# EAGLE design E_Key_BT (EAGLE 6.4)
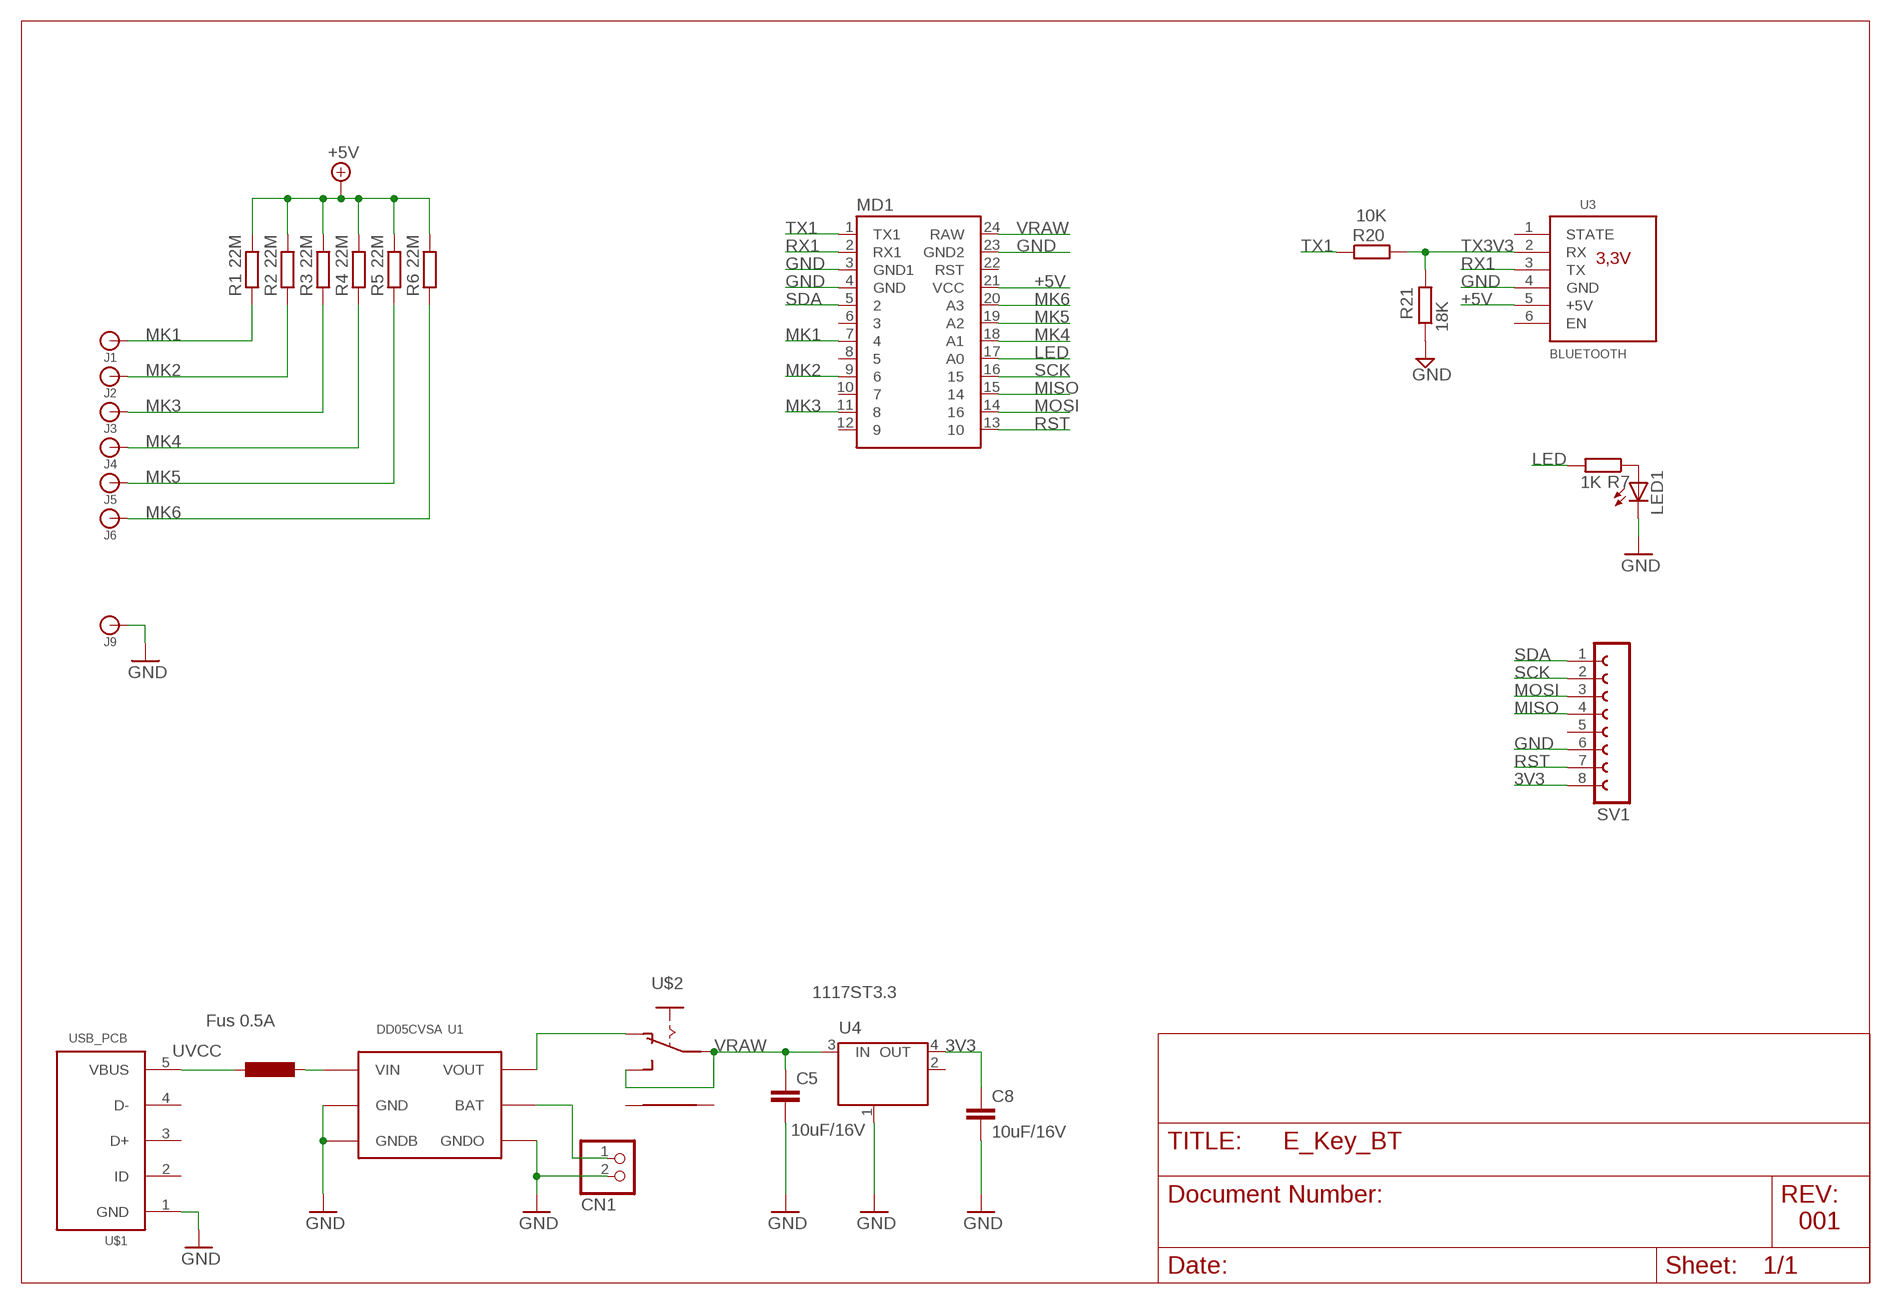
[diagram p0: schematic, sheet 1]

## Parts
C5  10uF/16V  C-EUC1206  [C1206]
C8  10uF/16V  C-EUC1206  [C1206]
CN1  JST_2PIN-THM-RA  [JST-PH-2-THM-RA]
F1  Fus 0.5A  L-EU  [R1206]
J1  Hole  BANANA_CONN  [BANANA_CONN]
J2  Hole  BANANA_CONN  [BANANA_CONN]
J3  Hole  BANANA_CONN  [BANANA_CONN]
J4  Hole  BANANA_CONN  [BANANA_CONN]
J5  Hole  BANANA_CONN  [BANANA_CONN]
J6  Hole  BANANA_CONN  [BANANA_CONN]
J9  Hole  BANANA_CONN  [BANANA_CONN]
LED1  LED3MM  [LED3MM]
MD1  PRO_MICRO  [PRO_MICRO]
R1  22M  R-EU_R0603  [R0603]
R2  22M  R-EU_R0603  [R0603]
R3  22M  R-EU_R0603  [R0603]
R4  22M  R-EU_R0603  [R0603]
R5  22M  R-EU_R0603  [R0603]
R6  22M  R-EU_R0603  [R0603]
R7  1K  R-EU_R0603  [R0603]
R20  10K  R-EU_R0603  [R0603]
R21  18K  R-EU_R0603  [R0603]
SV1  FE08-1  [FE08]
U1  DD05CVSA  [DD05CVSA]
U3  BLUETOOTH  BLUETOOTH_MODULE  [BLUETOOTH_MODULE]
U4  1117ST3.3  MC33269ST-3.3T3  [SOT223]
U$1  USB_PCB  [USB_PCB]
U$2  ESCORNA_SK12F14D  [ESCORNA_SK-12D07]

## Nets
3V3: C8.1 SV1.8 U4.4(OUT)
+5V: MD1.21(VCC) R1.2 R2.2 R3.2 R4.2 R5.2 R6.2 U3.5(+5V)
GND [power]: C5.2 C8.2 CN1.2 J9.P$1 LED1.K(C) MD1.3(GND1) MD1.4(GND) MD1.23(GND2) R21.1 SV1.6 U1.P$2(GND) U1.P$4(GNDB) U1.P$5(GNDO) U3.4(GND) U4.1(GND/ADJ) U$1.1(GND)
LED: MD1.17(A0) R7.2
MISO: MD1.15 SV1.4
MK1: J1.P$1 MD1.7 R1.1
MK2: J2.P$1 MD1.9 R2.1
MK3: J3.P$1 MD1.11 R3.1
MK4: J4.P$1 MD1.18(A1) R4.1
MK5: J5.P$1 MD1.19(A2) R5.1
MK6: J6.P$1 MD1.20(A3) R6.1
MOSI: MD1.14 SV1.3
N$1: U1.P$6(VOUT) U$2.P$2(O)
N$2: LED1.A R7.1
N$4: F1.1 U1.P$1(VIN)
N$6: CN1.1 U1.P$3(BAT)
RST: MD1.13 SV1.7
RX1: MD1.2(RX1) U3.3(TX)
SCK: MD1.16 SV1.2
SDA: MD1.5 SV1.1
TX1: MD1.1(TX1) R20.1
TX3V3: R20.2 R21.2 U3.2(RX)
UVCC: F1.2 U$1.5(VBUS)
VRAW: C5.1 MD1.24(RAW) U4.3(IN) U$2.P$1(P) U$2.P$3(S)
Unconnected: MD1.6 MD1.8 MD1.10 MD1.12 MD1.22(RST) SV1.5 U3.1(STATE) U3.6(EN) U4.2(OUT) U$1.2(ID) U$1.3(D+) U$1.4(D-) U$2.P$4 U$2.P$5

## Notes on the sheet
- 001

## Library data of the parts
C5 C8 = rcl:C-EU: CAPACITOR, European symbol
CN1 = adafruit:JST_2PIN: JST 2-Pin Connectors of various flavors SMT-RA (S2B-PH-SM4) 4UConnector #17311 SMT (B2B-PH-SM4) THM-RA (S2B-PH) THM (B2B-PH)
F1 = rcl:L-EU: INDUCTOR, European symbol
J1-J6 J9 = SparkFun-Connectors:BANANA_CONN: Through-hole banana jack
LED1 = led:LED: LED OSRAM: - CHIPLED LG R971, LG N971, LY N971, LG Q971, LY Q971, LO R971, LY R971 LH N974, LH R974 LS Q976, LO Q976, LY Q976 LO Q996 - Hyper CHIPLED LW Q18S LB Q993, LB Q99A, LB R99A - SideLED LS A670, LO A670, LY A670, LG A670, LP A670 LB A673, LV A673, LT A673, LW A673 LH A674 LY A675 LS A676, LA A676, LO A676, LY A676, LW A676 LS A679, LY A679, LG A679 - Hyper Micro SIDELED® LS Y876, LA Y876, LO Y876, LY Y876 LT Y87S - SmartLED LW L88C, LW L88S LB L89C, LB L89S, LG L890 LS L89K, LO L89K, LY L89K LS L896, LA L896, LO L896, LY L896 - TOPLED LS T670, LO T670, LY T670, LG T670, LP T670 LSG T670, LSP T670, LSY T670, LOP T670, LYG T670 LG T671, LOG T671, LSG T671 LB T673, LV T673, LT T673, LW T673 LH T674 LS T676, LA T676, LO T676, LY T676, LB T676, LH T676, LSB T676, LW T676 LB T67C, LV T67C, LT T67C, LS T67K, LO T67K, LY T67K, LW E67C LS E67B, LA E67B, LO E67B, LY E67B, LB E67C, LV E67C, LT E67C LW T67C LS T679, LY T679, LG T679 LS T770, LO T770, LY T770, LG T770, LP T770 LB T773, LV T773, LT T773, LW T773 LH T774 LS E675, LA E675, LY E675, LS T675 LS T776, LA T776, LO T776, LY T776, LB T776 LHGB T686 LT T68C, LB T68C - Hyper Mini TOPLED® LB M676 - Mini TOPLED Santana® LG M470 LS M47K, LO M47K, LY M47K Source: http://www.osram.convergy.de LUXEON: - LUMILED® LXK2-PW12-R00, LXK2-PW12-S00, LXK2-PW14-U00, LXK2-PW14-V00 LXK2-PM12-R00, LXK2-PM12-S00, LXK2-PM14-U00 LXK2-PE12-Q00, LXK2-PE12-R00, LXK2-PE12-S00, LXK2-PE14-T00, LXK2-PE14-U00 LXK2-PB12-K00, LXK2-PB12-L00, LXK2-PB12-M00, LXK2-PB14-N00, LXK2-PB14-P00, LXK2-PB14-Q00 LXK2-PR12-L00, LXK2-PR12-M00, LXK2-PR14-Q00, LXK2-PR14-R00 LXK2-PD12-Q00, LXK2-PD12-R00, LXK2-PD12-S00 LXK2-PH12-R00, LXK2-PH12-S00 LXK2-PL12-P00, LXK2-PL12-Q00, LXK2-PL12-R00 Source: www.luxeon.com KINGBRIGHT: KA-3528ASYC Source: www.kingbright.com
MD1 = Arduino_pro_micro:PRO_MICRO
R1-R7 R20 R21 = rcl:R-EU_: RESISTOR, European symbol
SV1 = con-lsta:FE08-1: FEMALE HEADER; OC_FARNELL: unknown; OC_NEWARK: unknown
U1 = escorna_LBREscorna_CPU_2_10:DD05CVSA
U3 = escorna_LBREscorna_CPU_2_10:BLUETOOTH_MODULE
U4 = linear:MC33269ST*: Adjustable Output Low Dropout Voltage Regulator 800 mA Source: http://www.onsemi.com/pub/Collateral/MC33269-D.PDF
U$1 = escorna_LBREscorna_CPU_2_10:USB_PCB
U$2 = escorna_ELIB:ESCORNA_SK12F14

## Net classes
0 default: width 0.254 mm, drill 0.61 mm, clearance 0.254 mm
1 power: width 0.254 mm, drill 0.61 mm, clearance 0.254 mm

## Board
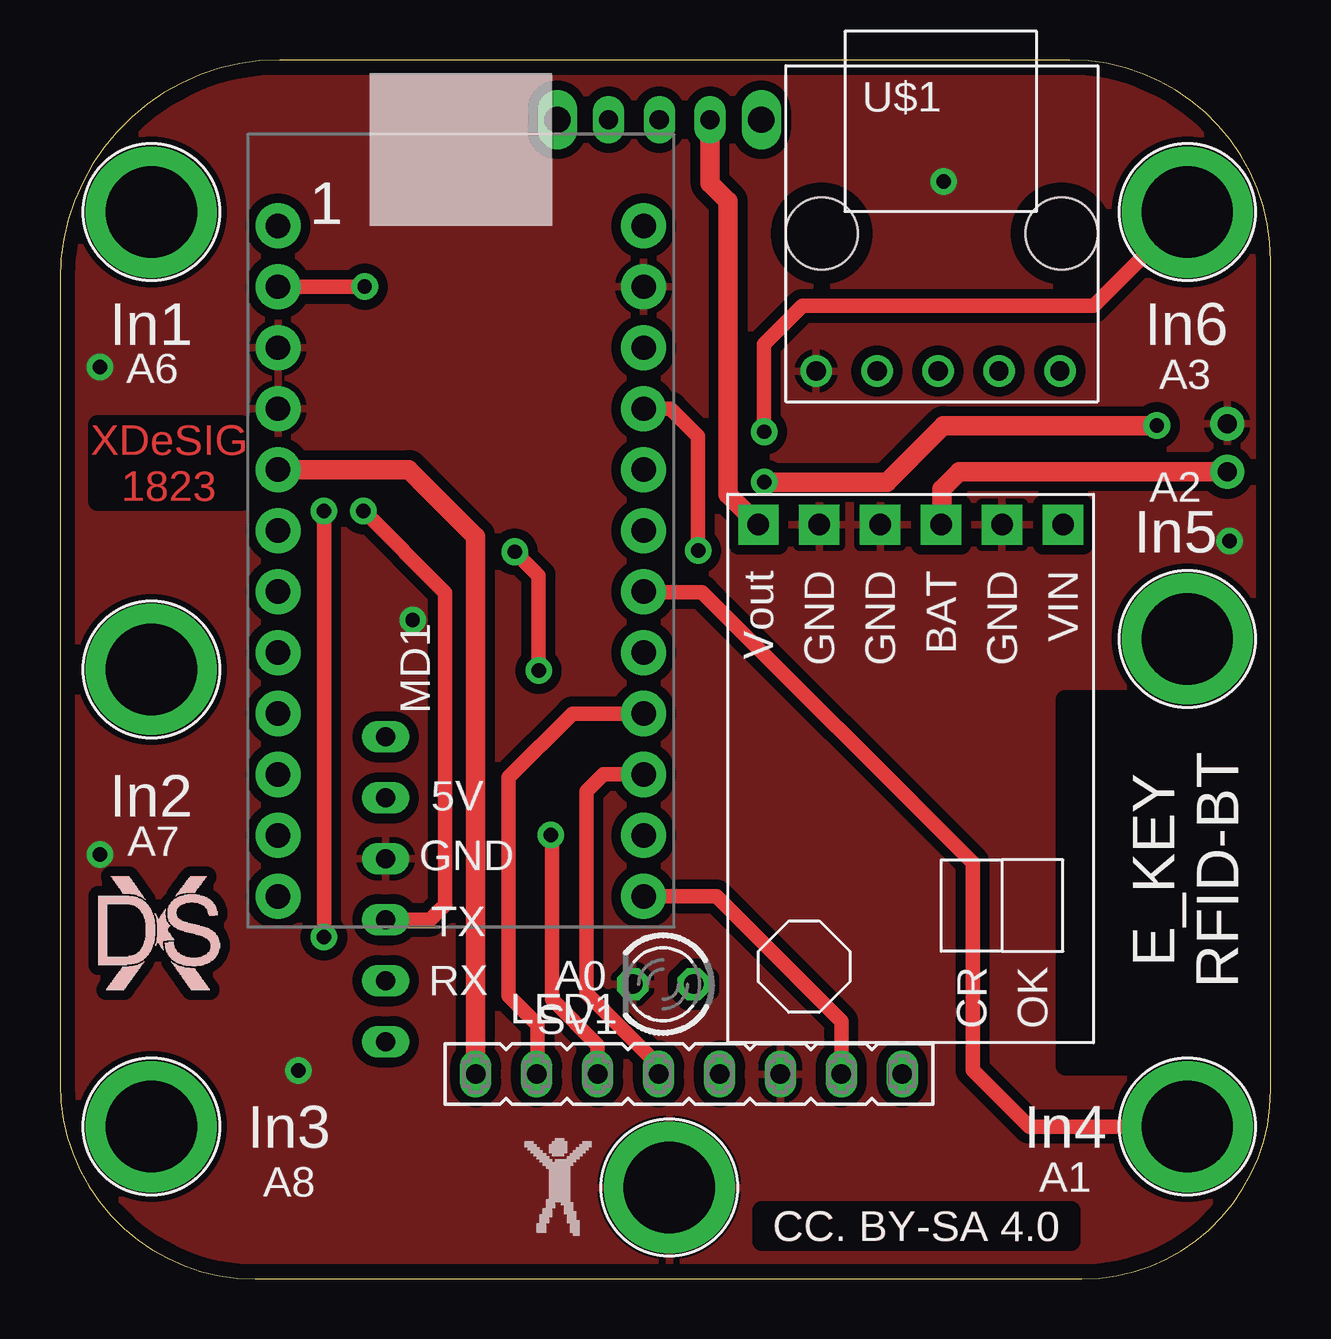
[diagram p1: board, top side]
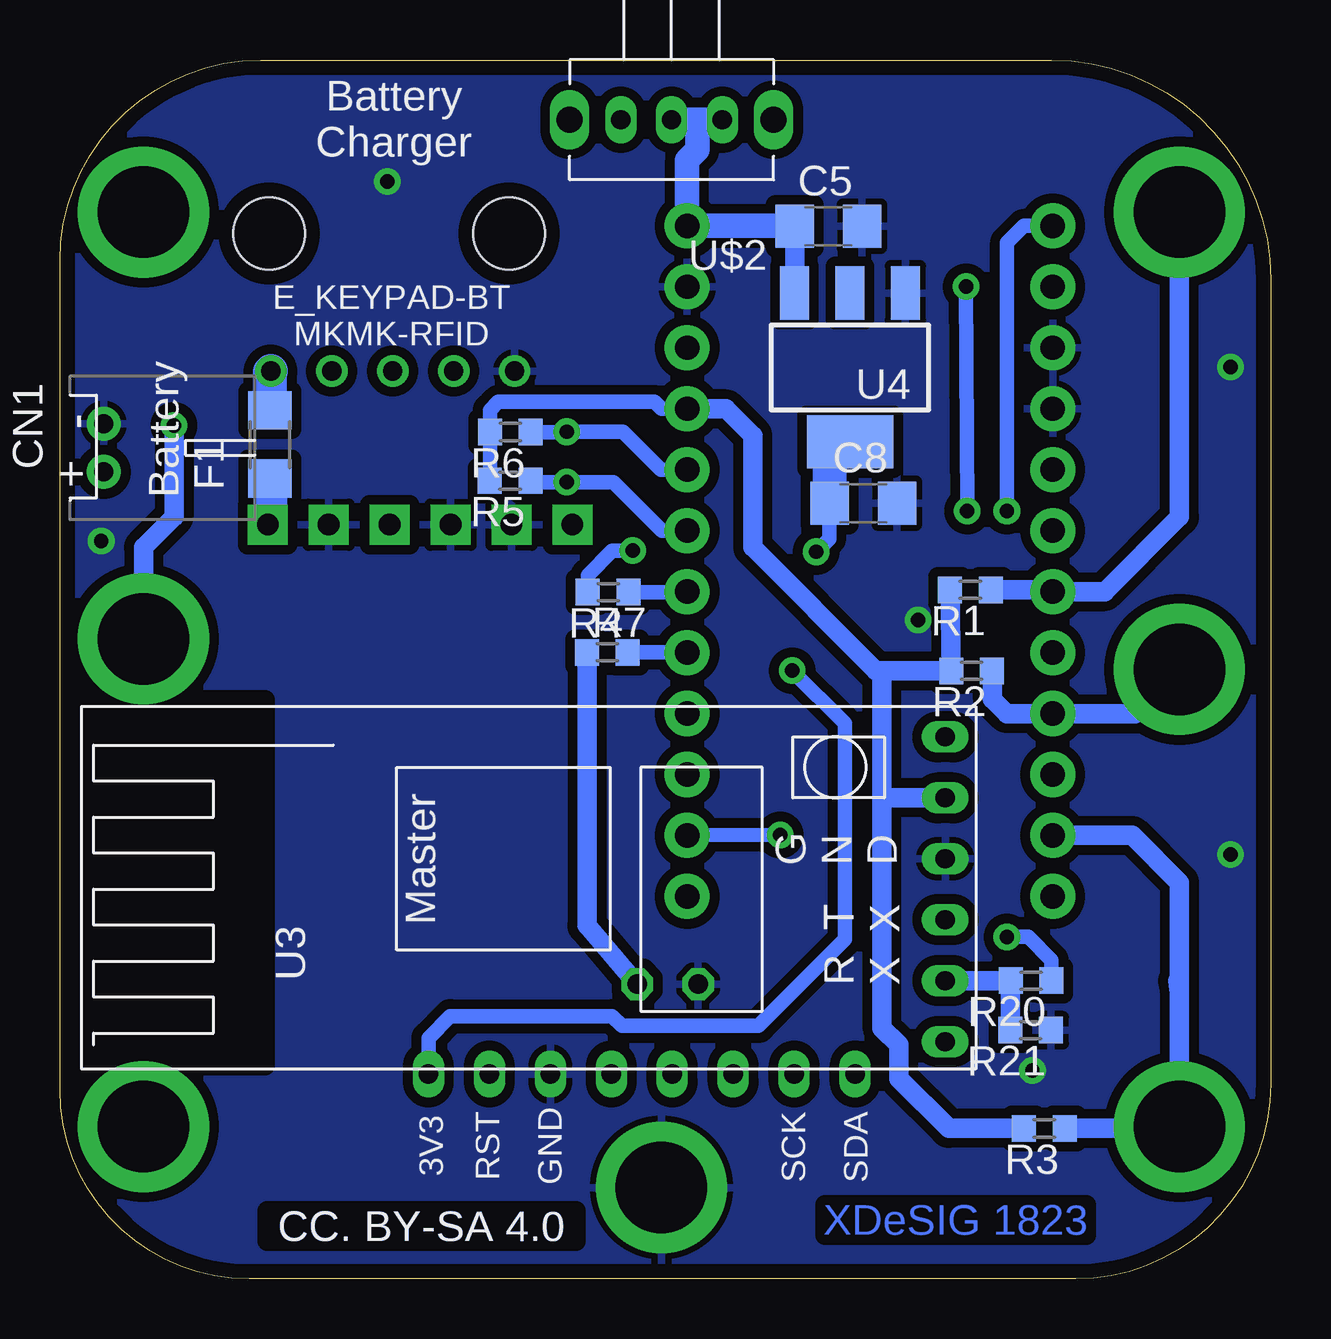
[diagram p2: board, bottom side, seen from below]

Size 50.47 x 50.79 mm. Coordinates in mm from the lower left corner, seen from the top.
Outline: 42.1,50.79 9.15,50.79 arc90 0,41.64 0,8.13 arc90 8.13,0 42.59,0 arc90 50.47,7.88 50.47,42.42 arc90 42.1,50.79
Copper layers (1*16): Top 0.035mm / dielectric 1.5mm / Bottom 0.035mm
Design rules "default": minimum track width 10mil, minimum drill 22mil, track to track 10mil, track to pad 10mil, pad to pad 8mil, via to via 12mil, smd to smd 8mil, copper to edge 24mil, drill to drill 12mil, minimum pad ring 10mil, minimum via ring 10mil, stop-mask expansion 2mil, vias tented up to drill 30mil, thermal gap 10mil
tRestrict: area 41.9,8.9 to 49.5,24.1
bRestrict: area 41.9,8.9 to 49.5,24.1

### Footprints (pad centres in the part's own frame; a part is rotated, then mirrored left to right if it is on the bottom)
C1206 = smd 1.6 x 1.8: 1 -1.4,0; 2 1.4,0
JST-PH-2-THM-RA = drill 0.8 pad 1.422: 1 1,0; 2 -1,0
R1206 = smd 1.6 x 1.803: 1 -1.422,0; 2 1.422,0
BANANA_CONN = drill 3.81 pad 5.461: P$1 0,0
LED3MM = drill 0.813 octagon: A -1.27,0; K 1.27,0
PRO_MICRO = drill 1.016 pad 1.88: 1 -7.62,11.43; 2 -7.62,8.89; 3 -7.62,6.35; 4 -7.62,3.81; 5 -7.62,1.27; 6 -7.62,-1.27; 7 -7.62,-3.81; 8 -7.62,-6.35; 9 -7.62,-8.89; 10 -7.62,-11.43; 11 -7.62,-13.97; 12 -7.62,-16.51; 13 7.62,-16.51; 14 7.62,-13.97; 15 7.62,-11.43; 16 7.62,-8.89; 17 7.62,-6.35; 18 7.62,-3.81; 19 7.62,-1.27; 20 7.62,1.27; 21 7.62,3.81; 22 7.62,6.35; 23 7.62,8.89; 24 7.62,11.43
R0603 = smd 1 x 1.1: 1 -0.85,0; 2 0.85,0
FE08 = drill 0.813 long: 1 -8.89,0; 2 -6.35,0; 3 -3.81,0; 4 -1.27,0; 5 1.27,0; 6 3.81,0; 7 6.35,0; 8 8.89,0
DD05CVSA = drill 0.9 pad 1.676 square: P$1 0,0; P$2 2.54,0; P$3 5.08,0; P$4 7.62,0; P$5 10.16,0; P$6 12.7,0
BLUETOOTH_MODULE = drill 0.8 long: 1 -6.35,-17.78; 2 -3.81,-17.78; 3 -1.27,-17.78; 4 1.27,-17.78; 5 3.81,-17.78; 6 6.35,-17.78
SOT223 = smd 1.219 x 2.235: 1 -2.311,-3.099; 2 0,-3.099; 3 2.311,-3.099 | smd 3.6 x 2.2: 4 0,3.099
USB_PCB = drill 0.8: 1 -5.08,-5.08; 2 -2.54,-5.08; 3 0,-5.08; 4 2.54,-5.08; 5 5.08,-5.08 | hole 3: -4.85,0.65; 5.15,0.65
ESCORNA_SK-12D07 = drill 0.8 long: P$1 0,0; P$2 2.115,0; P$3 -2.115,0 | drill 1.1 pad 1.27 long: P$4 -4.25,0; P$5 4.25,0

### Placement (x,y rotation side)
C5  18.44,43.86 0 bottom
C8  16.98,32.32 0 bottom
CN1  48.65,34.63 270 bottom
F1  41.72,34.77 90 bottom
J1  3.81,44.45 0 top
J2  3.81,25.4 0 top
J3  3.81,6.35 0 top
J4  46.99,6.35 0 top
J5  46.99,26.67 0 top
J6  46.99,44.45 0 top
J9  25.4,3.81 0 top
LED1  25.14,12.28 180 top
MD1  16.71,32.45 0 top
R1  12.52,28.71 180 bottom
R2  12.47,25.34 180 bottom
R3  9.44,6.27 180 bottom
R4  27.62,28.62 180 bottom
R5  31.71,33.26 180 bottom
R6  31.7,35.29 180 bottom
R7  27.66,26.11 0 bottom
R20  9.99,12.43 180 bottom
R21  10.01,10.37 180 bottom
SV1  26.22,8.54 0 top
U1  41.81,31.43 180 top
U3  31.35,16.24 90 bottom
U4  17.54,37.98 180 bottom
U$1  36.6,42.91 0 top
U$2  24.98,48.3 180 bottom
U$3  [XDESIG_CU]  1.6,12.05 0 top
U$4  [BODY]  18.79,1.87 0 top
U$5  [XDESIG]  1.6,12.05 0 top

### Tracks (layer width: path | path; a pad name or v marks a point on that pad's centre or on a via)
3V3  (via drill 0.6)
  Top 0.61: v19.95,25.35 19.95,29.3 v18.95,30.3
  Bottom 0.61: SV1.8 35.11,10.04 34.2,10.95 27.45,10.95 27.05,10.55 21.35,10.55 17.75,14.15 17.75,23.15 v19.95,25.35 20,25.3 | v18.95,30.3 18.4,30.85 18.4,32.3 C8.1
  Bottom 0.813: 17.94,34.48 U4.4
  Bottom 1.422: C8.1 18.38,34.04 17.94,34.48
+5V  (via drill 0.6)
  Top 0.61: MD1.21 25.45,36.26 26.6,35.11 v26.6,30.35
  Bottom 0.61: R6.2 32.6,35.5 | R6.2 32.55,36.2 32.2,36.55 25.69,36.55 25.4,36.26 MD1.21 | R6.2 R5.2 | R4.2 28.47,29.33 27.45,30.35 v26.6,30.35
  Bottom 0.813: R1.2 R2.2 16.2,25.34 | 16.2,20.32 16.2,25.34 | R3.2 13.42,6.27 15.5,8.35 15.5,9.75 16.2,10.45 16.2,20.32 | U3.5 15.93,20.05 16.2,20.32 | 16.2,25.34 16.45,25.34 21.59,30.48 21.59,35.14 22.7,36.25 MD1.21
GND  (via drill 0.6)
  other vias: 36.83,45.72 14.7,27.45 9.94,8.69 1.67,38 1.67,17.68 48.75,30.75
  pour Bottom (isolate 0.406): -1.27,52.07 52.07,52.07 52.07,-3.81 -1.27,-3.81
  pour Top (isolate 0.406): -1.27,52.07 52.07,52.07 52.07,-2.54 -1.27,-2.54
LED
  Bottom 0.61: R7.2 MD1.17
MISO
  Top 0.61: SV1.4 24.95,8.9 21.95,11.9 21.95,20.32 22.65,21.02 MD1.15
MK1
  Bottom 0.813: J1.P$1 3.81,31.75 6.92,28.64 MD1.7 9.16,28.71 R1.1
MK2
  Bottom 0.813: R2.1 11.6,25.32 11.6,24.15 11.01,23.56 MD1.9 5.65,23.56 J2.P$1
MK3
  Bottom 0.813: 3.81,11.95 3.81,16.51 5.78,18.48 MD1.11 | 3.81,11.95 J3.P$1 3.89,6.27 R3.1 | 3.88,12.42 3.81,11.95
MK4
  Top 0.61: J4.P$1 40.4,6.35 38.05,8.7 38.05,17.34 R4.1 24.35,28.62 MD1.18
  Bottom 0.61: R4.1 24.35,28.62 MD1.18
MK5  (via drill 0.6)
  Top 0.813: v29.35,33.2 34.47,33.2 36.83,35.56 v45.72,35.56
  Bottom 0.61: R5.1 30.8,33.2 v29.35,33.2 27.4,33.2 25.38,31.18 MD1.19
  Bottom 0.813: v45.72,35.56 45.72,31.75 46.99,30.48 J5.P$1
MK6  (via drill 0.6)
  Top 0.61: J6.P$1 43.09,40.55 30.95,40.55 29.35,38.95 v29.35,35.3
  Bottom 0.61: R6.1 29.61,35.29 v29.35,35.3 27,35.3 25.42,33.72 MD1.20
MOSI  (via drill 0.6)
  Top 0.61: SV1.3 22.41,9.74 20.5,11.65 20.5,18.45 v20.45,18.5
  Bottom 0.61: v20.45,18.5 v20.44,18.5 MD1.14
N$1
  Top 0.813: U$2.P$2 27.1,45.65 27.85,44.9 27.85,32.69 U1.P$6
N$2
  Bottom 0.813: R7.1 28.51,14.73 LED1.A
N$4
  Bottom 1.422: F1.1 41.72,31.52 U1.P$1
N$6
  Top 0.813: CN1.1 37.48,33.63 36.75,32.9 36.75,31.45 U1.P$3
RST
  Top 0.61: SV1.7 32.57,10.73 27.36,15.94 MD1.13
RX1  (via drill 0.6)
  Top 0.61: U3.3 15.42,14.97 16.05,15.6 16.05,28.6 v12.65,32 | MD1.2 v12.69,41.34 v12.7,41.35
  Bottom 0.61: v12.65,32 v12.7,41.35
SCK
  Top 0.61: SV1.2 19.9,8.57 19.9,10.6 18.7,11.8 18.7,20.9 21.36,23.56 MD1.16
SDA
  Top 0.813: SV1.1 17.33,30.93 14.54,33.72 MD1.5
TX1  (via drill 0.6)
  Top 0.61: v11,14.25 v11,32
  Bottom 0.61: R20.1 9.14,13.29 10.1,14.25 v11,14.25 | v11,32 11,43.18 10.3,43.88 MD1.1
TX3V3
  Bottom 0.813: R21.2 10.86,12.11 R20.2 U3.2
UVCC
  Bottom 1.422: F1.2 41.72,37.79 U$1.5
VRAW
  Bottom 0.813: C5.1 U4.3
  Bottom 1.016: 23.95,48.3 23.9,48.25 23.9,47.05 24.33,46.62 MD1.24 19.86,43.88 C5.1 | 23.95,48.3 U$2.P$3 | 23.95,48.3 U$2.P$1

### Text on the board
Top: XDeSIG / 1823 | CC. BY-SA 4.0
Bottom: XDeSIG 1823 | CC. BY-SA 4.0
tPlace: 1 | In1 | In6 | A6 | A3 | A2 | In5 | In2 | 5V | A7 | GND | E_KEY / RFID-BT | TX | A0 | RX | In3 | In4 | A8 | A1 | CC. BY-SA 4.0
bPlace: Battery / Charger | E_KEYPAD-BT / MKMK-RFID | Battery | Master | SDA | SCK | GND | RST | 3V3 | CC. BY-SA 4.0